# Altium schematic sheet SSD1306_SCH.SchDoc
size A4; SheetNumber: 1; SheetTotal: 1
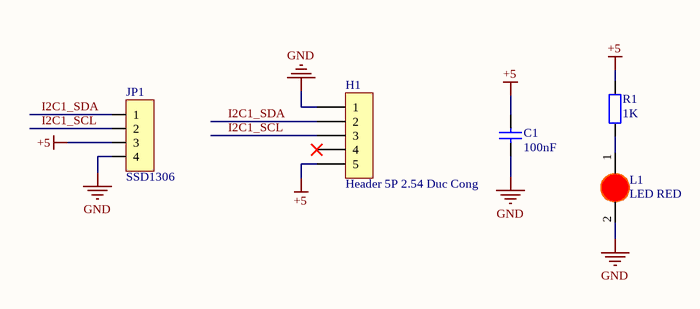
[diagram p0: SSD1306_SCH.SchDoc]

## Parts
C1  100nF  [tu 0603]
H1  Header 5P 2.54 Duc Cong  [Header 5P DC 2.54]
JP1  SSD1306  [JP 1x4 CT]
L1  LED RED  [LED-0805-Red]
R1  1K  [tro smd 0603]

## Nets
+5: C1.1 H1.5 JP1.3 R1.2
GND: C1.2 H1.1 JP1.4 L1.2(K)
I2C1_SCL: H1.3 JP1.2
I2C1_SDA: H1.2 JP1.1
NetL1_1: L1.1(A) R1.1

Not connected (* = marked no-connect by the designer): H1 4*

## Library data of the parts
C1 = Tu 0603 104 50V 10%: Dán; Don_Vi: Con; So_Chan: 2; Ten_Linh_Kien: Tụ 0603 104-100nF 10% 50V; Ma_Hang: MH004568; Chung_Loai: Dán; Kieu_Chan: *
H1 = Header 5P 2.54 Duc Cong: Cắm; Ten_Linh_Kien: Header 5P XH2.54-5P Đực Cong; Don_Vi: Con; Ma_Hang: MH001308; Chung_Loai: Cắm
JP1 = JP 1x4 2.54 Cai Thang: Cắm; Ten_Linh_Kien: Jump Đơn Cái 2.54MM 1x20P Thẳng; Don_Vi: Con; Ma_Hang: MH004006; Ghi_Chu: *; Kieu_Chan: *; Chung_Loai: Cắm
L1 = LED 0805 Do: Dán; Don_Vi: Con; Ma_Hang: MH000897; Ten_Linh_Kien: LED 0805 Màu Đỏ (Red); Ghi_Chu: *; Kieu_Chan: *; Chung_Loai: Dán
R1 = Tro 0603 1% 1k: Dán; So_Chan: 2; Don_Vi: Con; Ten_Linh_Kien: Trở 0603 1% 1k; Ma_Hang: MH006334; Chung_Loai: Dán; Kieu_Chan: *